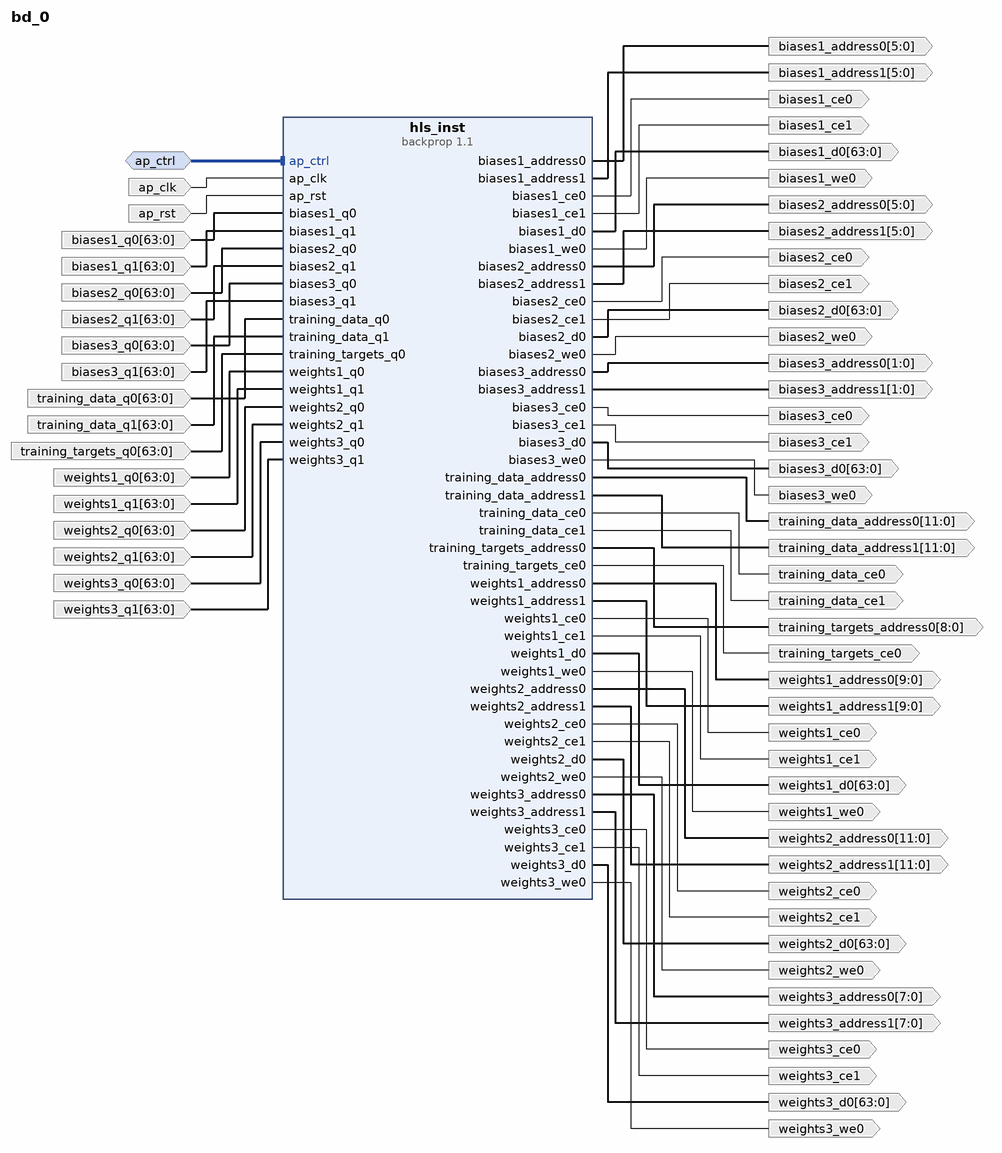
[diagram p0: block diagram of the top level]
# Vivado block design bd_0, xc7v585tffg1761-2, Vivado 2022.1
create_bd_design bd_0

create_bd_intf_port -mode Slave -vlnv xilinx.com:interface:acc_handshake_rtl:1.0 ap_ctrl
create_bd_port -dir I -type clk ap_clk
set_property -dict {CONFIG.FREQ_HZ 100000000.0} [get_bd_ports ap_clk]
create_bd_port -dir I -type rst ap_rst
set_property -dict {CONFIG.POLARITY ACTIVE_HIGH} [get_bd_ports ap_rst]
create_bd_port -dir O -from 5 -to 0 -type data biases1_address0
create_bd_port -dir O -from 5 -to 0 -type data biases1_address1
create_bd_port -dir O biases1_ce0
create_bd_port -dir O biases1_ce1
create_bd_port -dir O -from 63 -to 0 -type data biases1_d0
create_bd_port -dir I -from 63 -to 0 -type data biases1_q0
create_bd_port -dir I -from 63 -to 0 -type data biases1_q1
create_bd_port -dir O biases1_we0
create_bd_port -dir O -from 5 -to 0 -type data biases2_address0
create_bd_port -dir O -from 5 -to 0 -type data biases2_address1
create_bd_port -dir O biases2_ce0
create_bd_port -dir O biases2_ce1
create_bd_port -dir O -from 63 -to 0 -type data biases2_d0
create_bd_port -dir I -from 63 -to 0 -type data biases2_q0
create_bd_port -dir I -from 63 -to 0 -type data biases2_q1
create_bd_port -dir O biases2_we0
create_bd_port -dir O -from 1 -to 0 -type data biases3_address0
create_bd_port -dir O -from 1 -to 0 -type data biases3_address1
create_bd_port -dir O biases3_ce0
create_bd_port -dir O biases3_ce1
create_bd_port -dir O -from 63 -to 0 -type data biases3_d0
create_bd_port -dir I -from 63 -to 0 -type data biases3_q0
create_bd_port -dir I -from 63 -to 0 -type data biases3_q1
create_bd_port -dir O biases3_we0
create_bd_port -dir O -from 11 -to 0 -type data training_data_address0
create_bd_port -dir O -from 11 -to 0 -type data training_data_address1
create_bd_port -dir O training_data_ce0
create_bd_port -dir O training_data_ce1
create_bd_port -dir I -from 63 -to 0 -type data training_data_q0
create_bd_port -dir I -from 63 -to 0 -type data training_data_q1
create_bd_port -dir O -from 8 -to 0 -type data training_targets_address0
create_bd_port -dir O training_targets_ce0
create_bd_port -dir I -from 63 -to 0 -type data training_targets_q0
create_bd_port -dir O -from 9 -to 0 -type data weights1_address0
create_bd_port -dir O -from 9 -to 0 -type data weights1_address1
create_bd_port -dir O weights1_ce0
create_bd_port -dir O weights1_ce1
create_bd_port -dir O -from 63 -to 0 -type data weights1_d0
create_bd_port -dir I -from 63 -to 0 -type data weights1_q0
create_bd_port -dir I -from 63 -to 0 -type data weights1_q1
create_bd_port -dir O weights1_we0
create_bd_port -dir O -from 11 -to 0 -type data weights2_address0
create_bd_port -dir O -from 11 -to 0 -type data weights2_address1
create_bd_port -dir O weights2_ce0
create_bd_port -dir O weights2_ce1
create_bd_port -dir O -from 63 -to 0 -type data weights2_d0
create_bd_port -dir I -from 63 -to 0 -type data weights2_q0
create_bd_port -dir I -from 63 -to 0 -type data weights2_q1
create_bd_port -dir O weights2_we0
create_bd_port -dir O -from 7 -to 0 -type data weights3_address0
create_bd_port -dir O -from 7 -to 0 -type data weights3_address1
create_bd_port -dir O weights3_ce0
create_bd_port -dir O weights3_ce1
create_bd_port -dir O -from 63 -to 0 -type data weights3_d0
create_bd_port -dir I -from 63 -to 0 -type data weights3_q0
create_bd_port -dir I -from 63 -to 0 -type data weights3_q1
create_bd_port -dir O weights3_we0

create_bd_cell -type ip -vlnv xilinx.com:hls:backprop:1.1 hls_inst

# ---- connections ----

connect_bd_intf_net -intf_net ap_ctrl_0_1 [get_bd_intf_ports ap_ctrl] [get_bd_intf_pins hls_inst/ap_ctrl]
connect_bd_net -net ap_clk_0_1 [get_bd_ports ap_clk] [get_bd_pins hls_inst/ap_clk]
connect_bd_net -net ap_rst_0_1 [get_bd_ports ap_rst] [get_bd_pins hls_inst/ap_rst]
connect_bd_net -net biases1_q0_0_1 [get_bd_ports biases1_q0] [get_bd_pins hls_inst/biases1_q0]
connect_bd_net -net biases1_q1_0_1 [get_bd_ports biases1_q1] [get_bd_pins hls_inst/biases1_q1]
connect_bd_net -net biases2_q0_0_1 [get_bd_ports biases2_q0] [get_bd_pins hls_inst/biases2_q0]
connect_bd_net -net biases2_q1_0_1 [get_bd_ports biases2_q1] [get_bd_pins hls_inst/biases2_q1]
connect_bd_net -net biases3_q0_0_1 [get_bd_ports biases3_q0] [get_bd_pins hls_inst/biases3_q0]
connect_bd_net -net biases3_q1_0_1 [get_bd_ports biases3_q1] [get_bd_pins hls_inst/biases3_q1]
connect_bd_net [get_bd_pins hls_inst/biases1_address0] [get_bd_ports biases1_address0]
connect_bd_net [get_bd_pins hls_inst/biases1_address1] [get_bd_ports biases1_address1]
connect_bd_net [get_bd_pins hls_inst/biases1_ce0] [get_bd_ports biases1_ce0]
connect_bd_net [get_bd_pins hls_inst/biases1_ce1] [get_bd_ports biases1_ce1]
connect_bd_net [get_bd_pins hls_inst/biases1_d0] [get_bd_ports biases1_d0]
connect_bd_net [get_bd_pins hls_inst/biases1_we0] [get_bd_ports biases1_we0]
connect_bd_net [get_bd_pins hls_inst/biases2_address0] [get_bd_ports biases2_address0]
connect_bd_net [get_bd_pins hls_inst/biases2_address1] [get_bd_ports biases2_address1]
connect_bd_net [get_bd_pins hls_inst/biases2_ce0] [get_bd_ports biases2_ce0]
connect_bd_net [get_bd_pins hls_inst/biases2_ce1] [get_bd_ports biases2_ce1]
connect_bd_net [get_bd_pins hls_inst/biases2_d0] [get_bd_ports biases2_d0]
connect_bd_net [get_bd_pins hls_inst/biases2_we0] [get_bd_ports biases2_we0]
connect_bd_net [get_bd_pins hls_inst/biases3_address0] [get_bd_ports biases3_address0]
connect_bd_net [get_bd_pins hls_inst/biases3_address1] [get_bd_ports biases3_address1]
connect_bd_net [get_bd_pins hls_inst/biases3_ce0] [get_bd_ports biases3_ce0]
connect_bd_net [get_bd_pins hls_inst/biases3_ce1] [get_bd_ports biases3_ce1]
connect_bd_net [get_bd_pins hls_inst/biases3_d0] [get_bd_ports biases3_d0]
connect_bd_net [get_bd_pins hls_inst/biases3_we0] [get_bd_ports biases3_we0]
connect_bd_net [get_bd_pins hls_inst/training_data_address0] [get_bd_ports training_data_address0]
connect_bd_net [get_bd_pins hls_inst/training_data_address1] [get_bd_ports training_data_address1]
connect_bd_net [get_bd_pins hls_inst/training_data_ce0] [get_bd_ports training_data_ce0]
connect_bd_net [get_bd_pins hls_inst/training_data_ce1] [get_bd_ports training_data_ce1]
connect_bd_net [get_bd_pins hls_inst/training_targets_address0] [get_bd_ports training_targets_address0]
connect_bd_net [get_bd_pins hls_inst/training_targets_ce0] [get_bd_ports training_targets_ce0]
connect_bd_net [get_bd_pins hls_inst/weights1_address0] [get_bd_ports weights1_address0]
connect_bd_net [get_bd_pins hls_inst/weights1_address1] [get_bd_ports weights1_address1]
connect_bd_net [get_bd_pins hls_inst/weights1_ce0] [get_bd_ports weights1_ce0]
connect_bd_net [get_bd_pins hls_inst/weights1_ce1] [get_bd_ports weights1_ce1]
connect_bd_net [get_bd_pins hls_inst/weights1_d0] [get_bd_ports weights1_d0]
connect_bd_net [get_bd_pins hls_inst/weights1_we0] [get_bd_ports weights1_we0]
connect_bd_net [get_bd_pins hls_inst/weights2_address0] [get_bd_ports weights2_address0]
connect_bd_net [get_bd_pins hls_inst/weights2_address1] [get_bd_ports weights2_address1]
connect_bd_net [get_bd_pins hls_inst/weights2_ce0] [get_bd_ports weights2_ce0]
connect_bd_net [get_bd_pins hls_inst/weights2_ce1] [get_bd_ports weights2_ce1]
connect_bd_net [get_bd_pins hls_inst/weights2_d0] [get_bd_ports weights2_d0]
connect_bd_net [get_bd_pins hls_inst/weights2_we0] [get_bd_ports weights2_we0]
connect_bd_net [get_bd_pins hls_inst/weights3_address0] [get_bd_ports weights3_address0]
connect_bd_net [get_bd_pins hls_inst/weights3_address1] [get_bd_ports weights3_address1]
connect_bd_net [get_bd_pins hls_inst/weights3_ce0] [get_bd_ports weights3_ce0]
connect_bd_net [get_bd_pins hls_inst/weights3_ce1] [get_bd_ports weights3_ce1]
connect_bd_net [get_bd_pins hls_inst/weights3_d0] [get_bd_ports weights3_d0]
connect_bd_net [get_bd_pins hls_inst/weights3_we0] [get_bd_ports weights3_we0]
connect_bd_net -net training_data_q0_0_1 [get_bd_ports training_data_q0] [get_bd_pins hls_inst/training_data_q0]
connect_bd_net -net training_data_q1_0_1 [get_bd_ports training_data_q1] [get_bd_pins hls_inst/training_data_q1]
connect_bd_net -net training_targets_q0_0_1 [get_bd_ports training_targets_q0] [get_bd_pins hls_inst/training_targets_q0]
connect_bd_net -net weights1_q0_0_1 [get_bd_ports weights1_q0] [get_bd_pins hls_inst/weights1_q0]
connect_bd_net -net weights1_q1_0_1 [get_bd_ports weights1_q1] [get_bd_pins hls_inst/weights1_q1]
connect_bd_net -net weights2_q0_0_1 [get_bd_ports weights2_q0] [get_bd_pins hls_inst/weights2_q0]
connect_bd_net -net weights2_q1_0_1 [get_bd_ports weights2_q1] [get_bd_pins hls_inst/weights2_q1]
connect_bd_net -net weights3_q0_0_1 [get_bd_ports weights3_q0] [get_bd_pins hls_inst/weights3_q0]
connect_bd_net -net weights3_q1_0_1 [get_bd_ports weights3_q1] [get_bd_pins hls_inst/weights3_q1]

validate_bd_design
save_bd_design
